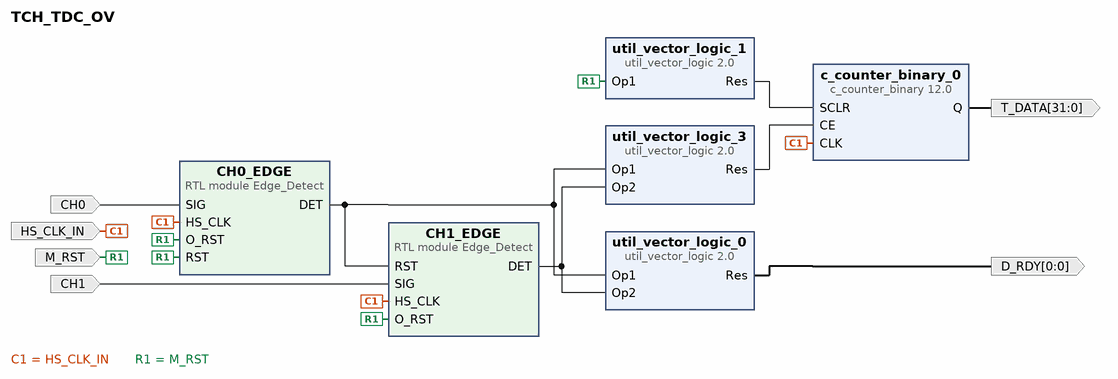
[diagram p0: block diagram of the top level]
# Vivado block design TCH_TDC_OV, xc7z020clg400-1, Vivado 2019.1
create_bd_design TCH_TDC_OV

create_bd_port -dir I HS_CLK_IN
create_bd_port -dir I CH0
create_bd_port -dir I CH1
create_bd_port -dir I M_RST
create_bd_port -dir O -from 0 -to 0 D_RDY
create_bd_port -dir O -from 31 -to 0 T_DATA

create_bd_cell -type ip -vlnv xilinx.com:ip:util_vector_logic:2.0 util_vector_logic_0
set_property -dict {CONFIG.C_OPERATION and CONFIG.C_SIZE 1} [get_bd_cells util_vector_logic_0]
create_bd_cell -type module -reference Edge_Detect CH1_EDGE
create_bd_cell -type module -reference Edge_Detect CH0_EDGE
create_bd_cell -type ip -vlnv xilinx.com:ip:c_counter_binary:12.0 c_counter_binary_0
set_property -dict {CONFIG.CE true CONFIG.Output_Width 32 CONFIG.SCLR true} [get_bd_cells c_counter_binary_0]
create_bd_cell -type ip -vlnv xilinx.com:ip:util_vector_logic:2.0 util_vector_logic_1
set_property -dict {CONFIG.C_OPERATION not CONFIG.C_SIZE 1} [get_bd_cells util_vector_logic_1]
create_bd_cell -type ip -vlnv xilinx.com:ip:util_vector_logic:2.0 util_vector_logic_3
set_property -dict {CONFIG.C_OPERATION xor CONFIG.C_SIZE 1} [get_bd_cells util_vector_logic_3]

# ---- connections ----

connect_bd_net -net clk_wiz_0_clk_out1 [get_bd_ports HS_CLK_IN] \
  [get_bd_pins CH1_EDGE/HS_CLK] [get_bd_pins CH0_EDGE/HS_CLK] [get_bd_pins c_counter_binary_0/CLK]
connect_bd_net -net CH0_1 [get_bd_ports CH0] [get_bd_pins CH0_EDGE/SIG]
connect_bd_net -net CH1_1 [get_bd_ports CH1] [get_bd_pins CH1_EDGE/SIG]
connect_bd_net [get_bd_ports M_RST] \
  [get_bd_pins CH1_EDGE/O_RST] [get_bd_pins CH0_EDGE/RST] [get_bd_pins CH0_EDGE/O_RST] [get_bd_pins util_vector_logic_1/Op1]
connect_bd_net [get_bd_pins CH0_EDGE/DET] [get_bd_pins util_vector_logic_0/Op1] [get_bd_pins CH1_EDGE/RST] [get_bd_pins util_vector_logic_3/Op1]
connect_bd_net [get_bd_pins util_vector_logic_0/Res] [get_bd_ports D_RDY]
connect_bd_net [get_bd_pins CH1_EDGE/DET] [get_bd_pins util_vector_logic_0/Op2] [get_bd_pins util_vector_logic_3/Op2]
connect_bd_net [get_bd_pins c_counter_binary_0/Q] [get_bd_ports T_DATA]
connect_bd_net [get_bd_pins util_vector_logic_1/Res] [get_bd_pins c_counter_binary_0/SCLR]
connect_bd_net [get_bd_pins util_vector_logic_3/Res] [get_bd_pins c_counter_binary_0/CE]

validate_bd_design
save_bd_design
